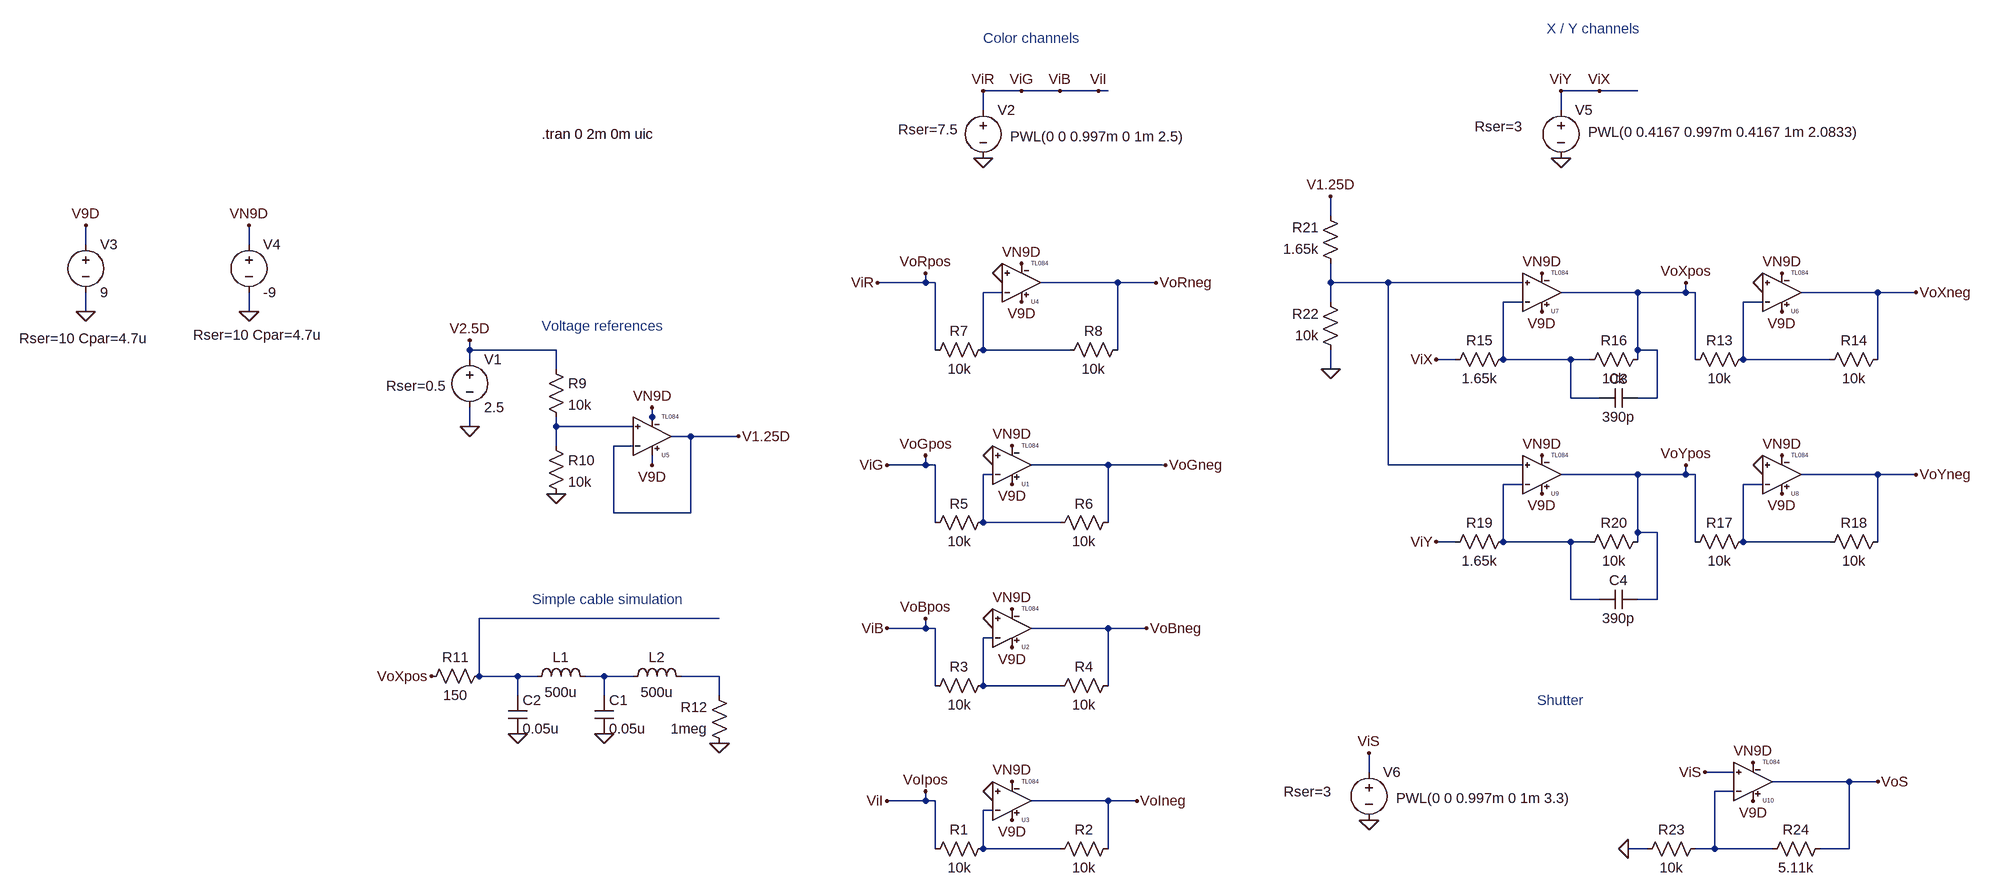
[diagram p0: schematic lasdac.asc]
lasdac.asc, the LTspice schematic file:
Version 4
SHEET 1 2920 1924
WIRE 1184 -544 1120 -544
WIRE 1248 -544 1184 -544
WIRE 1312 -544 1248 -544
WIRE 1328 -544 1312 -544
WIRE 2272 -544 2208 -544
WIRE 2336 -544 2272 -544
WIRE 1120 -512 1120 -544
WIRE 2208 -512 2208 -544
WIRE 1824 -336 1824 -368
WIRE -464 -288 -464 -320
WIRE -192 -288 -192 -320
WIRE 1024 -224 1024 -240
WIRE 1024 -224 944 -224
WIRE 1040 -224 1024 -224
WIRE 1344 -224 1216 -224
WIRE 1408 -224 1344 -224
WIRE 1824 -224 1824 -256
WIRE 1920 -224 1824 -224
WIRE 2144 -224 1920 -224
WIRE 1152 -208 1120 -208
WIRE 2336 -208 2208 -208
WIRE 2416 -208 2416 -224
WIRE 2416 -208 2336 -208
WIRE 2432 -208 2416 -208
WIRE 2736 -208 2608 -208
WIRE 2800 -208 2736 -208
WIRE 1824 -192 1824 -224
WIRE 2144 -192 2112 -192
WIRE 2544 -192 2512 -192
WIRE -464 -176 -464 -208
WIRE -192 -176 -192 -208
WIRE 176 -112 176 -128
WIRE 320 -112 176 -112
WIRE 1040 -112 1040 -224
WIRE 1120 -112 1120 -208
WIRE 1264 -112 1120 -112
WIRE 1344 -112 1344 -224
WIRE 2336 -112 2336 -208
WIRE 2368 -112 2336 -112
WIRE 176 -96 176 -112
WIRE 2032 -96 2000 -96
WIRE 2112 -96 2112 -192
WIRE 2224 -96 2112 -96
WIRE 2256 -96 2224 -96
WIRE 2336 -96 2336 -112
WIRE 2432 -96 2432 -208
WIRE 2512 -96 2512 -192
WIRE 2656 -96 2512 -96
WIRE 2736 -96 2736 -208
WIRE 320 -80 320 -112
WIRE 1824 -80 1824 -112
WIRE 2224 -32 2224 -96
WIRE 2272 -32 2224 -32
WIRE 2368 -32 2368 -112
WIRE 2368 -32 2336 -32
WIRE 480 0 480 -16
WIRE 176 16 176 -16
WIRE 320 16 320 0
WIRE 448 16 320 16
WIRE 480 16 480 0
WIRE 544 32 512 32
WIRE 624 32 544 32
WIRE 320 48 320 16
WIRE 448 48 416 48
WIRE 480 80 480 64
WIRE 1024 80 1024 64
WIRE 1024 80 960 80
WIRE 1040 80 1024 80
WIRE 1328 80 1200 80
WIRE 1424 80 1328 80
WIRE 1920 80 1920 -224
WIRE 2144 80 1920 80
WIRE 1136 96 1120 96
WIRE 2336 96 2208 96
WIRE 2416 96 2416 80
WIRE 2416 96 2336 96
WIRE 2432 96 2416 96
WIRE 2736 96 2608 96
WIRE 2800 96 2736 96
WIRE 2144 112 2112 112
WIRE 2544 112 2512 112
WIRE 416 160 416 48
WIRE 544 160 544 32
WIRE 544 160 416 160
WIRE 1040 176 1040 80
WIRE 1120 176 1120 96
WIRE 1248 176 1120 176
WIRE 1328 176 1328 80
WIRE 2336 192 2336 96
WIRE 2368 192 2336 192
WIRE 2032 208 2000 208
WIRE 2112 208 2112 112
WIRE 2224 208 2112 208
WIRE 2256 208 2224 208
WIRE 2336 208 2336 192
WIRE 2432 208 2432 96
WIRE 2512 208 2512 112
WIRE 2656 208 2512 208
WIRE 2736 208 2736 96
WIRE 2224 304 2224 208
WIRE 2272 304 2224 304
WIRE 2368 304 2368 192
WIRE 2368 304 2336 304
WIRE 592 336 192 336
WIRE 1024 352 1024 336
WIRE 1024 352 960 352
WIRE 1040 352 1024 352
WIRE 1328 352 1200 352
WIRE 1392 352 1328 352
WIRE 1136 368 1120 368
WIRE 192 432 192 336
WIRE 256 432 192 432
WIRE 288 432 256 432
WIRE 400 432 368 432
WIRE 448 432 400 432
WIRE 592 432 528 432
WIRE 1040 448 1040 352
WIRE 1120 448 1120 368
WIRE 1248 448 1120 448
WIRE 1328 448 1328 352
WIRE 256 464 256 432
WIRE 400 464 400 432
WIRE 592 464 592 432
WIRE 1888 592 1888 560
WIRE 2496 592 2448 592
WIRE 2688 608 2560 608
WIRE 2736 608 2688 608
WIRE 2496 624 2464 624
WIRE 1024 640 1024 624
WIRE 1024 640 960 640
WIRE 1040 640 1024 640
WIRE 1328 640 1200 640
WIRE 1376 640 1328 640
WIRE 1136 656 1120 656
WIRE 1040 720 1040 640
WIRE 1120 720 1120 656
WIRE 1248 720 1120 720
WIRE 1328 720 1328 640
WIRE 2352 720 2320 720
WIRE 2464 720 2464 624
WIRE 2464 720 2432 720
WIRE 2560 720 2464 720
WIRE 2688 720 2688 608
WIRE 2688 720 2640 720
FLAG 176 16 0
FLAG 176 -128 V2.5D
FLAG 1184 -256 VN9D
FLAG 1168 48 VN9D
FLAG 1168 320 VN9D
FLAG 1168 608 VN9D
FLAG 1184 -192 V9D
FLAG 1168 112 V9D
FLAG 1168 384 V9D
FLAG 1168 672 V9D
FLAG 1152 -240 0
FLAG 1136 64 0
FLAG 1136 336 0
FLAG 1136 624 0
FLAG 1024 -240 VoRpos
FLAG 1024 64 VoGpos
FLAG 1024 336 VoBpos
FLAG 1024 624 VoIpos
FLAG 960 352 ViB
FLAG 960 80 ViG
FLAG 944 -224 ViR
FLAG 960 640 ViI
FLAG 1392 352 VoBneg
FLAG 1424 80 VoGneg
FLAG 1408 -224 VoRneg
FLAG 1376 640 VoIneg
FLAG 1120 -432 0
FLAG 1120 -544 ViR
FLAG 480 -16 VN9D
FLAG 480 80 V9D
FLAG 624 32 V1.25D
FLAG 320 128 0
FLAG 256 528 0
FLAG 400 528 0
FLAG 592 544 0
FLAG 112 432 VoXpos
FLAG 1184 -544 ViG
FLAG 1248 -544 ViB
FLAG 1312 -544 ViI
FLAG 2208 -432 0
FLAG 2208 -544 ViY
FLAG 2272 -544 ViX
FLAG 2576 -240 VN9D
FLAG 2576 -176 V9D
FLAG 2544 -224 0
FLAG 2416 -224 VoXpos
FLAG 2800 -208 VoXneg
FLAG 2176 -240 VN9D
FLAG 2176 -176 V9D
FLAG 2000 -96 ViX
FLAG 2576 64 VN9D
FLAG 2576 128 V9D
FLAG 2544 80 0
FLAG 2416 80 VoYpos
FLAG 2800 96 VoYneg
FLAG 2176 64 VN9D
FLAG 2176 128 V9D
FLAG 2000 208 ViY
FLAG 1824 -368 V1.25D
FLAG 1824 -80 0
FLAG 2528 576 VN9D
FLAG 2528 640 V9D
FLAG 2736 608 VoS
FLAG 1888 672 0
FLAG 1888 560 ViS
FLAG 2448 592 ViS
FLAG 2320 720 0
FLAG -464 -176 0
FLAG -464 -320 V9D
FLAG -192 -176 0
FLAG -192 -320 VN9D
SYMBOL voltage 176 -112 R0
WINDOW 123 0 0 Left 2
WINDOW 39 -139 60 Left 2
SYMATTR SpiceLine Rser=0.5
SYMATTR InstName V1
SYMATTR Value 2.5
SYMBOL voltage 1120 -528 R0
WINDOW 123 24 124 Left 2
WINDOW 39 -142 49 Left 2
WINDOW 3 45 60 Left 2
SYMATTR SpiceLine Rser=7.5
SYMATTR Value PWL(0 0 0.997m 0 1m 2.5)
SYMATTR InstName V2
SYMBOL tl084 1168 144 M180
SYMATTR InstName U1
SYMBOL tl084 1168 416 M180
SYMATTR InstName U2
SYMBOL tl084 1168 704 M180
SYMATTR InstName U3
SYMBOL tl084 1184 -160 M180
SYMATTR InstName U4
SYMBOL res 1136 704 R90
WINDOW 0 0 56 VBottom 2
WINDOW 3 32 56 VTop 2
SYMATTR InstName R1
SYMATTR Value 10k
SYMATTR SpiceLine tol=1
SYMBOL res 1344 704 R90
WINDOW 0 0 56 VBottom 2
WINDOW 3 32 56 VTop 2
SYMATTR InstName R2
SYMATTR Value 10k
SYMATTR SpiceLine tol=1
SYMBOL res 1136 432 R90
WINDOW 0 0 56 VBottom 2
WINDOW 3 32 56 VTop 2
SYMATTR InstName R3
SYMATTR Value 10k
SYMATTR SpiceLine tol=1
SYMBOL res 1344 432 R90
WINDOW 0 0 56 VBottom 2
WINDOW 3 32 56 VTop 2
SYMATTR InstName R4
SYMATTR Value 10k
SYMATTR SpiceLine tol=1
SYMBOL res 1136 160 R90
WINDOW 0 0 56 VBottom 2
WINDOW 3 32 56 VTop 2
SYMATTR InstName R5
SYMATTR Value 10k
SYMATTR SpiceLine tol=1
SYMBOL res 1344 160 R90
WINDOW 0 0 56 VBottom 2
WINDOW 3 32 56 VTop 2
SYMATTR InstName R6
SYMATTR Value 10k
SYMATTR SpiceLine tol=1
SYMBOL res 1136 -128 R90
WINDOW 0 0 56 VBottom 2
WINDOW 3 32 56 VTop 2
SYMATTR InstName R7
SYMATTR Value 10k
SYMATTR SpiceLine tol=1
SYMBOL res 1360 -128 R90
WINDOW 0 0 56 VBottom 2
WINDOW 3 32 56 VTop 2
SYMATTR InstName R8
SYMATTR Value 10k
SYMATTR SpiceLine tol=1
SYMBOL tl084 480 96 M180
SYMATTR InstName U5
SYMBOL res 304 -96 R0
SYMATTR InstName R9
SYMATTR Value 10k
SYMATTR SpiceLine tol=1
SYMBOL res 304 32 R0
SYMATTR InstName R10
SYMATTR Value 10k
SYMATTR SpiceLine tol=1
SYMBOL cap 384 464 R0
SYMATTR InstName C1
SYMATTR Value 0.05u
SYMBOL cap 240 464 R0
SYMATTR InstName C2
SYMATTR Value 0.05u
SYMBOL res 208 416 R90
WINDOW 0 0 56 VBottom 2
WINDOW 3 32 56 VTop 2
SYMATTR InstName R11
SYMATTR Value 150
SYMATTR SpiceLine tol=1
SYMBOL ind 272 448 R270
WINDOW 0 32 56 VTop 2
WINDOW 3 5 56 VBottom 2
SYMATTR InstName L1
SYMATTR Value 500u
SYMATTR SpiceLine Rser=100
SYMBOL ind 432 448 R270
WINDOW 0 32 56 VTop 2
WINDOW 3 5 56 VBottom 2
SYMATTR InstName L2
SYMATTR Value 500u
SYMATTR SpiceLine Rser=100
SYMBOL res 608 560 R180
WINDOW 0 36 76 Left 2
WINDOW 3 36 40 Left 2
SYMATTR InstName R12
SYMATTR Value 1meg
SYMATTR SpiceLine tol=1
SYMBOL voltage 2208 -528 R0
WINDOW 123 24 124 Left 2
WINDOW 39 -144 44 Left 2
WINDOW 3 45 53 Left 2
SYMATTR SpiceLine Rser=3
SYMATTR Value PWL(0 0.4167 0.997m 0.4167 1m 2.0833)
SYMATTR InstName V5
SYMBOL tl084 2576 -144 M180
SYMATTR InstName U6
SYMBOL res 2528 -112 R90
WINDOW 0 0 56 VBottom 2
WINDOW 3 32 56 VTop 2
SYMATTR InstName R13
SYMATTR Value 10k
SYMATTR SpiceLine tol=1
SYMBOL res 2752 -112 R90
WINDOW 0 0 56 VBottom 2
WINDOW 3 32 56 VTop 2
SYMATTR InstName R14
SYMATTR Value 10k
SYMATTR SpiceLine tol=1
SYMBOL tl084 2176 -144 M180
SYMATTR InstName U7
SYMBOL res 2128 -112 R90
WINDOW 0 0 56 VBottom 2
WINDOW 3 32 56 VTop 2
SYMATTR InstName R15
SYMATTR Value 1.65k
SYMATTR SpiceLine tol=1
SYMBOL res 2352 -112 R90
WINDOW 0 0 56 VBottom 2
WINDOW 3 32 56 VTop 2
SYMATTR InstName R16
SYMATTR Value 10k
SYMATTR SpiceLine tol=1
SYMBOL tl084 2576 160 M180
SYMATTR InstName U8
SYMBOL res 2528 192 R90
WINDOW 0 0 56 VBottom 2
WINDOW 3 32 56 VTop 2
SYMATTR InstName R17
SYMATTR Value 10k
SYMATTR SpiceLine tol=1
SYMBOL res 2752 192 R90
WINDOW 0 0 56 VBottom 2
WINDOW 3 32 56 VTop 2
SYMATTR InstName R18
SYMATTR Value 10k
SYMATTR SpiceLine tol=1
SYMBOL tl084 2176 160 M180
SYMATTR InstName U9
SYMBOL res 2128 192 R90
WINDOW 0 0 56 VBottom 2
WINDOW 3 32 56 VTop 2
SYMATTR InstName R19
SYMATTR Value 1.65k
SYMATTR SpiceLine tol=1
SYMBOL res 2352 192 R90
WINDOW 0 0 56 VBottom 2
WINDOW 3 32 56 VTop 2
SYMATTR InstName R20
SYMATTR Value 10k
SYMATTR SpiceLine tol=1
SYMBOL res 1840 -240 R180
WINDOW 0 36 76 Left 2
WINDOW 3 36 40 Left 2
SYMATTR InstName R21
SYMATTR Value 1.65k
SYMATTR SpiceLine tol=1
SYMBOL res 1840 -96 R180
WINDOW 0 36 76 Left 2
WINDOW 3 36 40 Left 2
SYMATTR InstName R22
SYMATTR Value 10k
SYMATTR SpiceLine tol=1
SYMBOL tl084 2528 672 M180
SYMATTR InstName U10
SYMBOL res 2448 704 R90
WINDOW 0 0 56 VBottom 2
WINDOW 3 32 56 VTop 2
SYMATTR InstName R23
SYMATTR Value 10k
SYMATTR SpiceLine tol=1
SYMBOL res 2656 704 R90
WINDOW 0 0 56 VBottom 2
WINDOW 3 32 56 VTop 2
SYMATTR InstName R24
SYMATTR Value 5.11k
SYMATTR SpiceLine tol=1
SYMBOL voltage 1888 576 R0
WINDOW 123 24 124 Left 2
WINDOW 39 -142 49 Left 2
WINDOW 3 45 60 Left 2
SYMATTR SpiceLine Rser=3
SYMATTR Value PWL(0 0 0.997m 0 1m 3.3)
SYMATTR InstName V6
SYMBOL voltage -464 -304 R0
WINDOW 123 0 0 Left 2
WINDOW 39 -111 173 Left 2
SYMATTR SpiceLine Rser=10 Cpar=4.7u
SYMATTR InstName V3
SYMATTR Value 9
SYMBOL voltage -192 -304 R0
WINDOW 123 0 0 Left 2
WINDOW 39 -93 167 Left 2
SYMATTR SpiceLine Rser=10 Cpar=4.7u
SYMATTR InstName V4
SYMATTR Value -9
SYMBOL cap 2336 -48 R90
WINDOW 0 0 32 VBottom 2
WINDOW 3 32 32 VTop 2
SYMATTR InstName C3
SYMATTR Value 390p
SYMBOL cap 2336 288 R90
WINDOW 0 0 32 VBottom 2
WINDOW 3 32 32 VTop 2
SYMATTR InstName C4
SYMATTR Value 390p
TEXT 296 -472 Left 2 !.tran 0 2m 0m uic
TEXT 280 304 Left 2 ;Simple cable simulation
TEXT 296 -152 Left 2 ;Voltage references
TEXT 1120 -632 Left 2 ;Color channels
TEXT 2184 -648 Left 2 ;X / Y channels
TEXT 2168 472 Left 2 ;Shutter

The netlist it stands for:
* lasdac.asc
V1 V2.5D 0 2.5 Rser=0.5
V2 ViI 0 PWL(0 0 0.997m 0 1m 2.5) Rser=7.5
XU1 0 N006 V9D VN9D VoGneg TL084  ; pins In+ In- V+ V- OUT
XU2 0 N010 V9D VN9D VoBneg TL084  ; pins In+ In- V+ V- OUT
XU3 0 N014 V9D VN9D VoIneg TL084  ; pins In+ In- V+ V- OUT
XU4 0 N002 V9D VN9D VoRneg TL084  ; pins In+ In- V+ V- OUT
R1 N014 ViI 10k tol=1
R2 VoIneg N014 10k tol=1
R3 N010 ViI 10k tol=1
R4 VoBneg N010 10k tol=1
R5 N006 ViI 10k tol=1
R6 VoGneg N006 10k tol=1
R7 N002 ViI 10k tol=1
R8 VoRneg N002 10k tol=1
XU5 N005 V1.25D V9D VN9D V1.25D TL084  ; pins In+ In- V+ V- OUT
R9 V2.5D N005 10k tol=1
R10 N005 0 10k tol=1
C1 N011 0 0.05u
C2 N009 0 0.05u
R11 N009 VoXpos 150 tol=1
L1 N009 N011 500u Rser=100
L2 N011 N012 500u Rser=100
R12 0 N012 1meg tol=1
V5 ViX 0 PWL(0 0.4167 0.997m 0.4167 1m 2.0833) Rser=3
XU6 0 N004 V9D VN9D VoXneg TL084  ; pins In+ In- V+ V- OUT
R13 N004 VoXpos 10k tol=1
R14 VoXneg N004 10k tol=1
XU7 N001 N003 V9D VN9D VoXpos TL084  ; pins In+ In- V+ V- OUT
R15 N003 ViX 1.65k tol=1
R16 VoXpos N003 10k tol=1
XU8 0 N008 V9D VN9D VoYneg TL084  ; pins In+ In- V+ V- OUT
R17 N008 VoYpos 10k tol=1
R18 VoYneg N008 10k tol=1
XU9 N001 N007 V9D VN9D VoYpos TL084  ; pins In+ In- V+ V- OUT
R19 N007 ViX 1.65k tol=1
R20 VoYpos N007 10k tol=1
R21 N001 V1.25D 1.65k tol=1
R22 0 N001 10k tol=1
XU10 ViS N013 V9D VN9D VoS TL084  ; pins In+ In- V+ V- OUT
R23 N013 0 10k tol=1
R24 VoS N013 5.11k tol=1
V6 ViS 0 PWL(0 0 0.997m 0 1m 3.3) Rser=3
V3 V9D 0 9 Rser=10 Cpar=4.7u
V4 VN9D 0 -9 Rser=10 Cpar=4.7u
C3 VoXpos N003 390p
C4 VoYpos N007 390p
.tran 0 2m 0m uic
* Simple cable simulation
* Voltage references
* Color channels
* X / Y channels
* Shutter
.lib TL084.lib
.backanno
.end